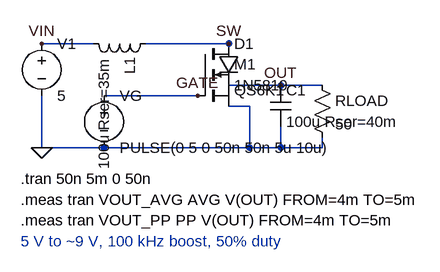
[diagram p0: schematic 13_boost_converter.asc]
13_boost_converter.asc, the LTspice schematic file:
Version 4
SHEET 1 880 680
WIRE 80 96 160 96
WIRE 240 96 368 96
WIRE 176 176 320 176
WIRE 80 176 80 256
WIRE 176 256 176 256
WIRE 368 192 400 192
WIRE 400 192 400 256
WIRE 368 160 512 160
WIRE 448 224 448 256
WIRE 512 240 512 256
WIRE 80 256 512 256
FLAG 80 256 0
FLAG 80 96 VIN
FLAG 320 176 GATE
FLAG 368 96 SW
FLAG 448 160 OUT
SYMBOL voltage 80 80 R0
SYMATTR InstName V1
SYMATTR Value 5
SYMBOL voltage 176 160 R0
SYMATTR InstName VG
SYMATTR Value PULSE(0 5 0 50n 50n 5u 10u)
SYMBOL ind 256 80 R90
SYMATTR InstName L1
SYMATTR Value 100u Rser=35m
SYMBOL nmos 320 96 R0
SYMATTR InstName M1
SYMATTR Value QS6K1
SYMBOL diode 352 96 R0
SYMATTR InstName D1
SYMATTR Value 1N5819
SYMBOL cap 432 160 R0
SYMATTR InstName C1
SYMATTR Value 100u Rser=40m
SYMBOL res 496 144 R0
SYMATTR InstName RLOAD
SYMATTR Value 50
TEXT 48 304 Left 2 !.tran 50n 5m 0 50n
TEXT 48 336 Left 2 !.meas tran VOUT_AVG AVG V(OUT) FROM=4m TO=5m
TEXT 48 368 Left 2 !.meas tran VOUT_PP PP V(OUT) FROM=4m TO=5m
TEXT 48 400 Left 2 ;5 V to ~9 V, 100 kHz boost, 50% duty

The netlist it stands for:
* 13_boost_converter.asc
V1 VIN 0 5
VG GATE 0 PULSE(0 5 0 50n 50n 5u 10u)
L1 SW VIN 100u Rser=35m
M1 SW GATE 0 0 QS6K1
D1 SW OUT 1N5819
C1 OUT 0 100u Rser=40m
RLOAD OUT 0 50
.model D D
.lib standard.dio
.model NMOS NMOS
.model PMOS PMOS
.lib standard.mos
.tran 50n 5m 0 50n
.meas tran VOUT_AVG AVG V(OUT) FROM=4m TO=5m
.meas tran VOUT_PP PP V(OUT) FROM=4m TO=5m
* 5 V to ~9 V, 100 kHz boost, 50% duty
.backanno
.end